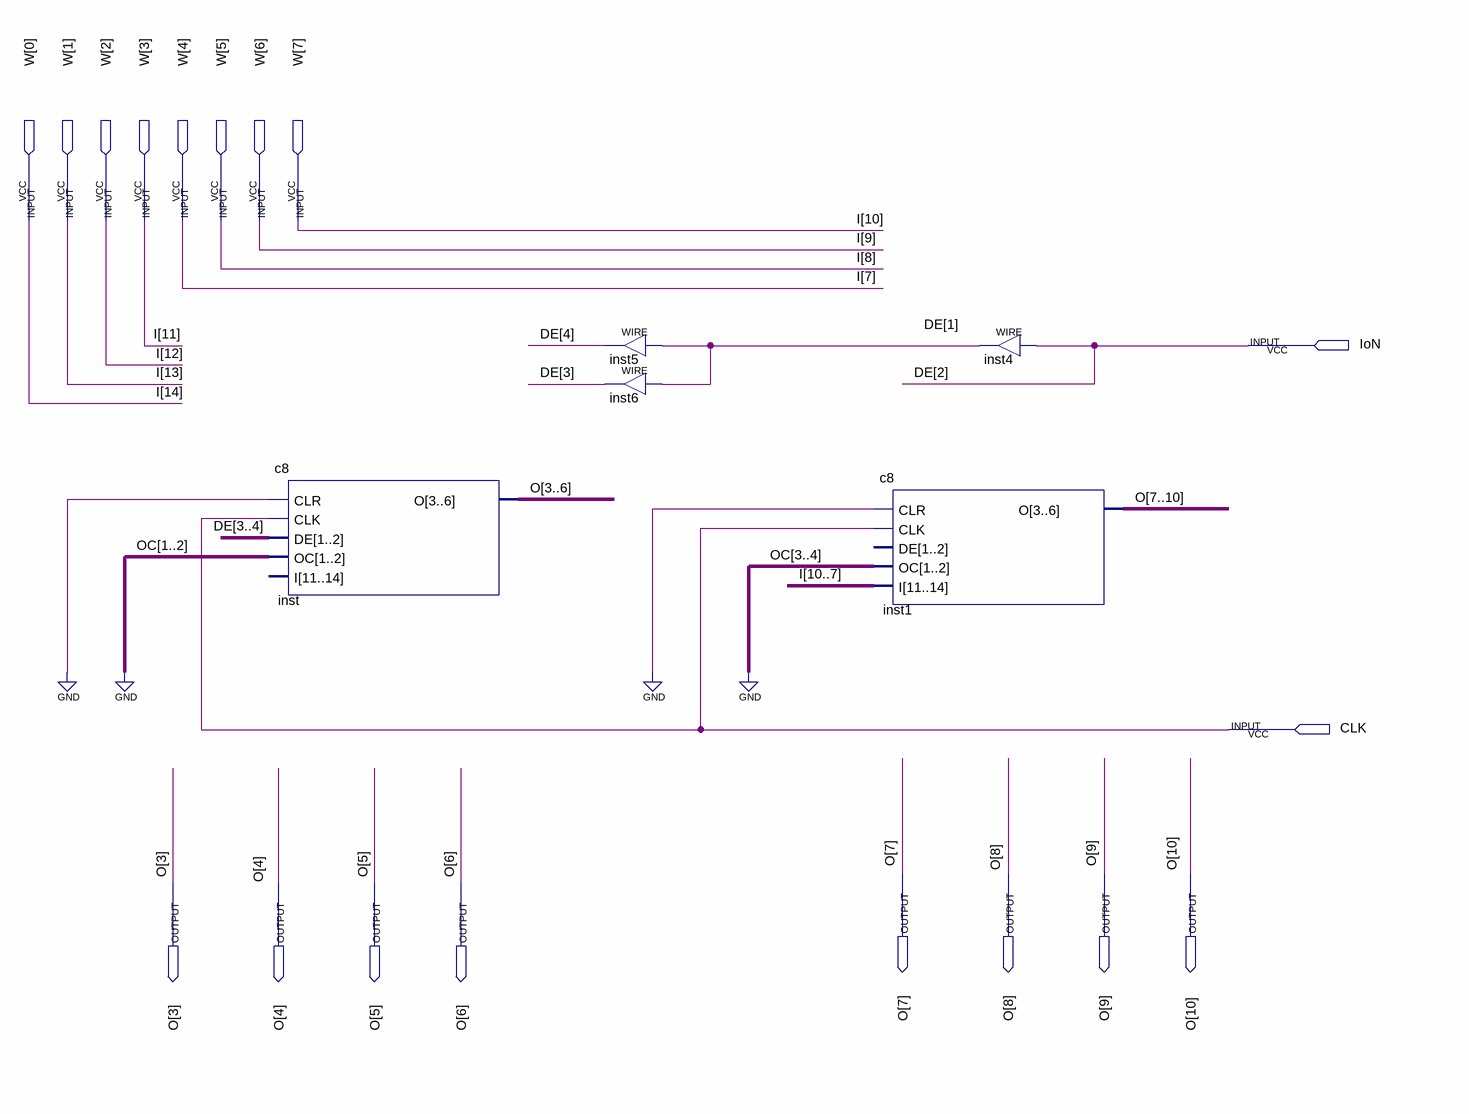
[diagram p0: schematic sheet]
// Quartus schematic output_register.bdf as structural Verilog: 5 symbols, 18 pins
module output_register (
  input  [7:0] W,
  input  IoN,
  input  CLK,
  output [10:3] O
);

  wire [4:1] DE;

  c8 inst (.CLR(1'b0), .CLK(CLK), .DE({DE[3], DE[4]}), .OC(2'b00), .O({O[3], O[4], O[5], O[6]}));  // open: I
  assign DE[4] = DE[1];  // WIRE inst5
  assign DE[3] = DE[1];  // WIRE inst6
  c8 inst1 (.CLR(1'b0), .CLK(CLK), .OC(2'b00), .I(W[7:4]), .O({O[7], O[8], O[9], O[10]}));  // open: DE
  assign DE[1] = IoN;  // WIRE inst4

  // Other names for the same wires on the sheet: DE[2] = IoN; I[14:7] = {W[0], W[1], W[2], W[3], W[7:4]}
endmodule
